# Altium schematic sheet Peripherals.SchDoc
size A; SheetNumber: 4; SheetTotal: 4
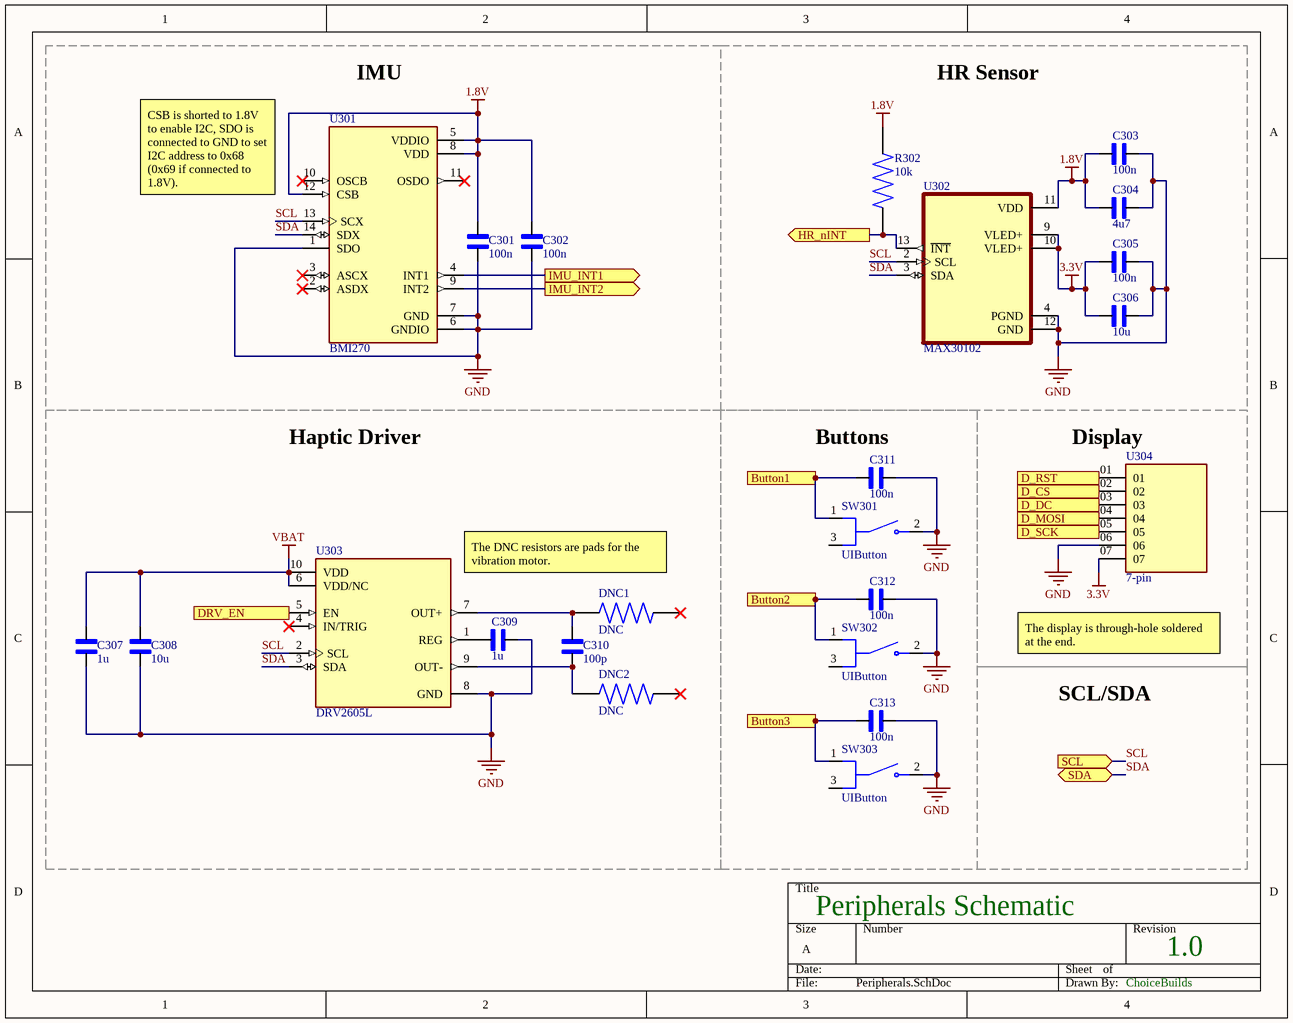
[diagram p0: Peripherals.SchDoc]

## Parts
C301  100n  [0402c]
C302  100n  [0402c]
C303  100n  [0402c]
C304  4u7  [0603c]
C305  100n  [0402c]
C306  10u  [0603c]
C307  1u  [0402c]
C308  10u  [0402c]
C309  1u  [0603c]
C310  100p  [0402c]
C311  100n  [0402c]
C312  100n  [0402c]
C313  100n  [0402c]
DNC1  DNC  [0805r]
DNC2  DNC  [0805r]
R302  10k  [0402r]
SW301  UIButton  [TL3340AF160QG]
SW302  UIButton  [TL3340AF160QG]
SW303  UIButton  [TL3340AF160QG]
U301  BMI270  [BMI270]
U302  MAX30102  [MAX30102]
U303  DRV2605L  [DRV2605L]
U304  7-pin  [7-pin]

## Blocks framed on the sheet
IMU: C301 C302 U301
HR Sensor: C303-C306 R302 U302
Haptic Driver: C307-C310 DNC1 DNC2 U303
Buttons: C311-C313 SW301-SW303
Display: U304

## Ports
Button1 (in), Button2 (in), Button3 (in), D_CS (in), D_DC (in), D_MOSI (in), D_RST (in), D_SCK (in), DRV_EN (in), HR_nINT (out), IMU_INT1 (out), IMU_INT2 (out), SCL (in), SDA (bidir)

## Nets
1.8V: C301.2 C302.2 C303.2 C304.2 R302.2 U301.5(VDDIO) U301.8(VDD) U301.12(CSB) U302.11(VDD)
3.3V: C305.2 C306.2 U302.9(VLED+) U302.10(VLED+) U304.07
GND: C301.1 C302.1 C303.1 C304.1 C305.1 C306.1 C307.1 C308.1 C309.2 C311.2 C312.2 C313.2 SW301.2(NO) SW302.2(NO) SW303.2(NO) U301.1(SDO) U301.6(GNDIO) U301.7(GND) U302.4(PGND) U302.12(GND) U303.8(GND) U304.06
VBAT: C307.2 C308.2 U303.6(VDD/NC) U303.10(VDD)
Button1: C311.1 SW301.1(COM_1) ; port Button1
Button2: C312.1 SW302.1(COM_1) ; port Button2
Button3: C313.1 SW303.1(COM_1) ; port Button3
D_CS: U304.02 ; port D_CS
D_DC: U304.03 ; port D_DC
D_MOSI: U304.04 ; port D_MOSI
D_RST: U304.01 ; port D_RST
D_SCK: U304.05 ; port D_SCK
DRV_EN: U303.5(EN) ; port DRV_EN
HR_nINT: R302.1 U302.13(~{INT}) ; port HR_nINT
IMU_INT1: U301.4(INT1) ; port IMU_INT1
IMU_INT2: U301.9(INT2) ; port IMU_INT2
SCL: U301.13(SCX) U302.2(SCL) U303.2(SCL) ; port SCL
SDA: U301.14(SDX) U302.3(SDA) U303.3(SDA) ; port SDA
NetC309_1: C309.1 U303.1(REG)
NetC310_1: C310.1 DNC2.1 U303.9(OUT-)
NetC310_2: C310.2 DNC1.1 U303.7(OUT+)

Not connected (* = marked no-connect by the designer): DNC1 2*; DNC2 2*; SW301 3(COM_2); SW302 3(COM_2); SW303 3(COM_2); U301 2(ASDX)* 3(ASCX)* 10(OSCB)* 11(OSDO)*; U303 4(IN/TRIG)*

## Notes on the sheet
- CSB is shorted to 1.8V to enable I2C, SDO is connected to GND to set I2C address to 0x68 (0x69 if connected to 1.8V).
- (near U303) The DNC resistors are pads for the vibration motor.
- The display is through-hole soldered at the end.
- SCL/SDA
- Peripherals Schematic
- 1.0
- ChoiceBuilds

## Library data of the parts
C301-C303 C305 C307 C308 C310-C313 = 0402c
C304 C306 C309 = 0603c
DNC1 DNC2 = 0805r
R302 = 0402r
SW301-SW303 = TL3340AF160QG